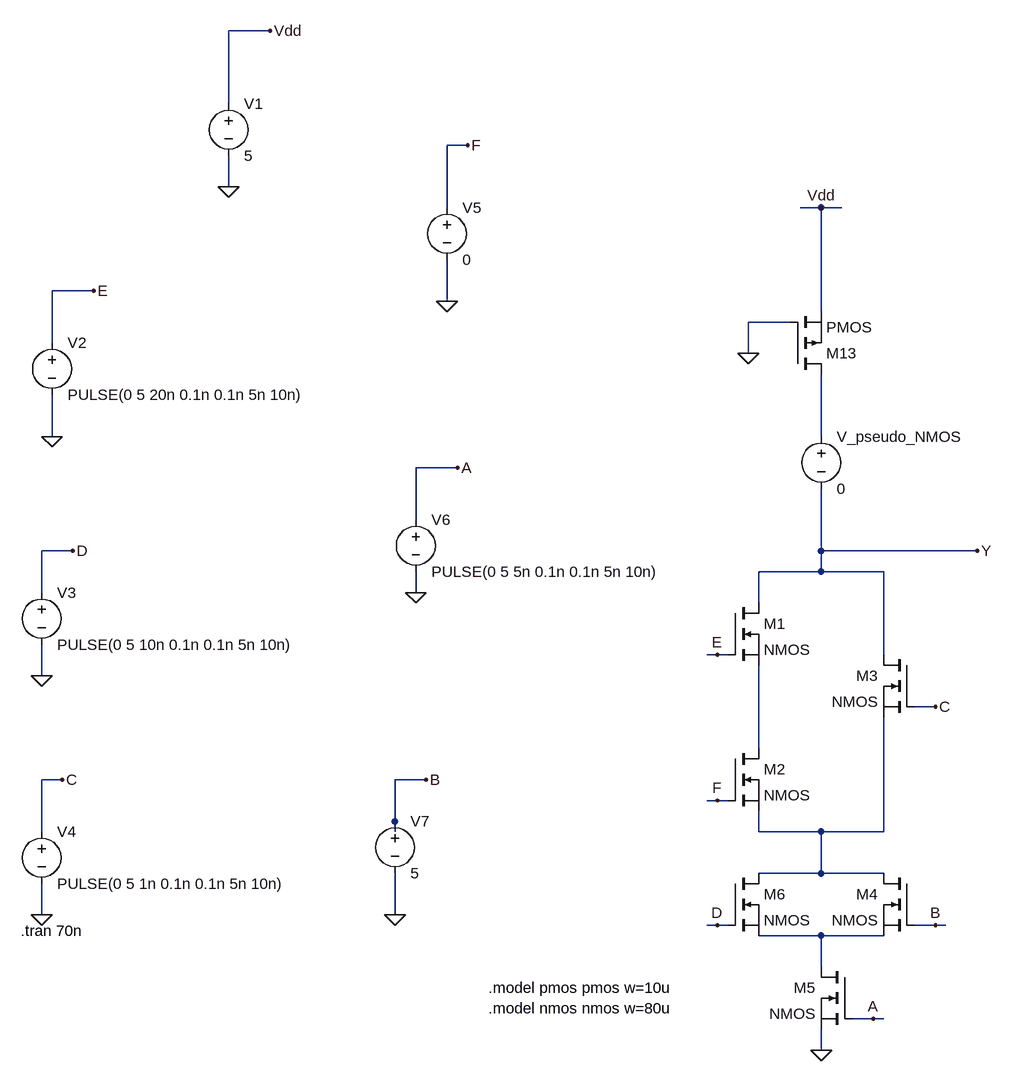
[diagram p0: schematic 5_2_2.asc]
5_2_2.asc, the LTspice schematic file:
Version 4
SHEET 1 1840 1012
WIRE -192 -576 -256 -576
WIRE -256 -464 -256 -576
WIRE 112 -400 80 -400
WIRE -256 -336 -256 -384
WIRE 80 -304 80 -400
WIRE 656 -304 624 -304
WIRE 688 -304 656 -304
WIRE -464 -176 -528 -176
WIRE 80 -160 80 -224
WIRE 656 -144 656 -304
WIRE 608 -128 544 -128
WIRE -528 -96 -528 -176
WIRE 544 -80 544 -128
WIRE -528 48 -528 -16
WIRE 656 48 656 -48
WIRE 96 96 32 96
WIRE 32 176 32 96
WIRE -496 224 -544 224
WIRE 656 224 656 128
WIRE 896 224 656 224
WIRE 656 256 656 224
WIRE 656 256 560 256
WIRE 752 256 656 256
WIRE -544 288 -544 224
WIRE 32 288 32 256
WIRE 560 304 560 256
WIRE 496 384 480 384
WIRE 512 384 496 384
WIRE 752 384 752 256
WIRE -544 416 -544 368
WIRE 832 464 800 464
WIRE 560 528 560 400
WIRE -512 576 -544 576
WIRE 48 576 0 576
WIRE 496 608 480 608
WIRE 512 608 496 608
WIRE 0 640 0 576
WIRE -544 656 -544 576
WIRE 0 656 0 640
WIRE 560 656 560 624
WIRE 656 656 560 656
WIRE 752 656 752 480
WIRE 752 656 656 656
WIRE 656 720 656 656
WIRE 656 720 560 720
WIRE 752 720 656 720
WIRE -544 784 -544 736
WIRE 0 784 0 720
WIRE 496 800 480 800
WIRE 512 800 496 800
WIRE 832 800 800 800
WIRE 848 800 832 800
WIRE 656 816 560 816
WIRE 752 816 656 816
WIRE 656 864 656 816
WIRE 736 944 704 944
WIRE 752 944 736 944
WIRE 656 992 656 960
FLAG 896 224 Y
FLAG 656 -304 Vdd
FLAG -192 -576 Vdd
FLAG -256 -336 0
FLAG -464 -176 E
FLAG 112 -400 F
FLAG -496 224 D
FLAG 96 96 A
FLAG -512 576 C
FLAG 48 576 B
FLAG -544 784 0
FLAG 0 784 0
FLAG 32 288 0
FLAG -544 416 0
FLAG -528 48 0
FLAG 80 -160 0
FLAG 656 992 0
FLAG 736 944 A
FLAG 832 800 B
FLAG 496 800 D
FLAG 832 464 C
FLAG 496 608 F
FLAG 496 384 E
FLAG 544 -80 0
SYMBOL nmos 512 304 R0
SYMATTR InstName M1
SYMBOL nmos 512 528 R0
SYMATTR InstName M2
SYMBOL nmos 800 384 M0
SYMATTR InstName M3
SYMBOL voltage -256 -480 R0
WINDOW 123 0 0 Left 0
WINDOW 39 0 0 Left 0
SYMATTR InstName V1
SYMATTR Value 5
SYMBOL voltage -528 -112 R0
WINDOW 123 0 0 Left 0
WINDOW 39 0 0 Left 0
SYMATTR InstName V2
SYMATTR Value PULSE(0 5 20n 0.1n 0.1n 5n 10n)
SYMBOL voltage -544 272 R0
WINDOW 123 0 0 Left 0
WINDOW 39 0 0 Left 0
SYMATTR InstName V3
SYMATTR Value PULSE(0 5 10n 0.1n 0.1n 5n 10n)
SYMBOL voltage -544 640 R0
WINDOW 123 0 0 Left 0
WINDOW 39 0 0 Left 0
SYMATTR InstName V4
SYMATTR Value PULSE(0 5 1n 0.1n 0.1n 5n 10n)
SYMBOL voltage 80 -320 R0
WINDOW 123 0 0 Left 0
WINDOW 39 0 0 Left 0
SYMATTR InstName V5
SYMATTR Value 0
SYMBOL voltage 32 160 R0
WINDOW 123 0 0 Left 0
WINDOW 39 0 0 Left 0
SYMATTR InstName V6
SYMATTR Value PULSE(0 5 5n 0.1n 0.1n 5n 10n)
SYMBOL voltage 0 624 R0
WINDOW 123 0 0 Left 0
WINDOW 39 0 0 Left 0
SYMATTR InstName V7
SYMATTR Value 5
SYMBOL nmos 800 720 M0
SYMATTR InstName M4
SYMBOL nmos 704 864 M0
SYMATTR InstName M5
SYMBOL nmos 512 720 R0
SYMATTR InstName M6
SYMBOL pmos 608 -48 M180
SYMATTR InstName M13
SYMBOL voltage 656 32 R0
SYMATTR InstName V_pseudo_NMOS
SYMATTR Value 0
TEXT -576 808 Left 2 !.tran 70n
TEXT 144 896 Left 2 !.model pmos pmos w=10u\n.model nmos nmos w=80u

The netlist it stands for:
* 5_2_2.asc
M1 Y E N002 N002 NMOS
M2 N002 F N003 N003 NMOS
M3 Y C N003 N003 NMOS
V1 Vdd 0 5
V2 E 0 PULSE(0 5 20n 0.1n 0.1n 5n 10n)
V3 D 0 PULSE(0 5 10n 0.1n 0.1n 5n 10n)
V4 C 0 PULSE(0 5 1n 0.1n 0.1n 5n 10n)
V5 F 0 0
V6 A 0 PULSE(0 5 5n 0.1n 0.1n 5n 10n)
V7 B 0 5
M4 N003 B N004 N004 NMOS
M5 N004 A 0 0 NMOS
M6 N003 D N004 N004 NMOS
M13 N001 0 Vdd Vdd PMOS
V_pseudo_NMOS N001 Y 0
.model NMOS NMOS
.model PMOS PMOS
.lib standard.mos
.tran 70n
.model pmos pmos w=10u
.model nmos nmos w=80u
.backanno
.end